# EAGLE design molex_breakout (EAGLE 7.7.0)
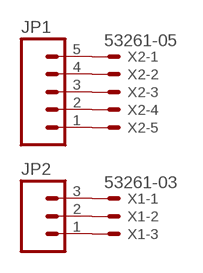
[diagram p0: schematic, sheet 1]

## Parts
JP1  M05PTH  [1X05]
JP2  M03PTH  [1X03]
X1  53261-03  [53261-03]
X2  53261-05  [53261-05]

## Nets
N$1: JP2.3 X1.1
N$2: JP2.2 X1.2
N$3: JP2.1 X1.3
N$4: JP1.5 X2.1
N$5: JP1.4 X2.2
N$6: JP1.3 X2.3
N$7: JP1.2 X2.4
N$8: JP1.1 X2.5

## Library data of the parts
JP1 = SparkFun-Connectors:M05: Header 5 Standard 5-pin 0.1" header. Use with straight break away headers (SKU : PRT-00116), right angle break away headers (PRT-00553), swiss pins (PRT-00743), machine pins (PRT-00117), and female headers (PRT-00115). Molex polarized connector foot print use with SKU : PRT-08230 with associated crimp pins and housings.
JP2 = SparkFun-Connectors:M03: Header 3 Standard 3-pin 0.1" header. Use with straight break away headers (SKU : PRT-00116), right angle break away headers (PRT-00553), swiss pins (PRT-00743), machine pins (PRT-00117), and female headers (PRT-00115). Molex polarized connector foot print use with SKU : PRT-08232 with associated crimp pins and housings.
X1 = con-molex:53?-03: CONNECTOR wire to board 1.25 mm (.049 inch) pitch header; MF: MOLEX; MPN: 53261-0390; OC_FARNELL: 1125359; OC_NEWARK: 57H5006
X2 = con-molex:53?-05: CONNECTOR wire to board 1.25 mm (.049 inch) pitch header; OC_FARNELL: 1433644; OC_NEWARK: unknown

## Board
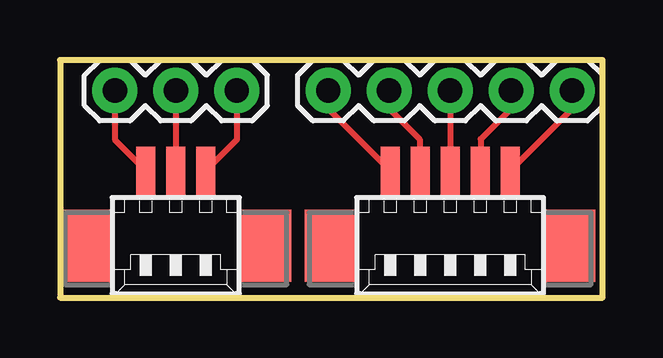
[diagram p1: board, top side]

Size 22.61 x 9.91 mm. Coordinates in mm from the lower left corner, seen from the top.
Outline: 0,0 22.61,0 22.61,9.91 0,9.91 0,0
Copper layers (1*16): Top 0.035mm / dielectric 1.5mm / Bottom 0.035mm
Design rules "default": minimum track width 10mil, minimum drill 24mil, track to track 8mil, track to pad 8mil, pad to pad 8mil, via to via 8mil, smd to smd 8mil, copper to edge 40mil, drill to drill 8mil, minimum pad ring 10mil, minimum via ring 8mil, stop-mask expansion 4mil, vias tented up to drill 0mil, thermal gap 10mil

### Footprints (pad centres in the part's own frame; a part is rotated, then mirrored left to right if it is on the bottom)
1X05 = drill 1.016 pad 1.88: 1 0,0; 2 2.54,0; 3 5.08,0; 4 7.62,0; 5 10.16,0
1X03 = drill 1.016 pad 1.88: 1 0,0; 2 2.54,0; 3 5.08,0
53261-03 = smd 0.8 x 2: 1 1.25,-2.5; 2 0,-2.5; 3 -1.25,-2.5 | smd 2.1 x 3: S1 3.75,0.625; S2 -3.75,0.625
53261-05 = smd 0.8 x 2: 1 2.5,-2.5; 2 1.25,-2.5; 3 0,-2.5; 4 -1.25,-2.5; 5 -2.5,-2.5 | smd 2.1 x 3: S1 5,0.625; S2 -5,0.625

### Placement (x,y rotation side)
JP1  21.34,8.64 180 top
JP2  7.37,8.64 180 top
X1  4.83,2.79 180 top
X2  16.26,2.79 180 top

### Tracks (layer width: path | path; a pad name or v marks a point on that pad's centre or on a via)
N$1
  Top 0.254: JP2.3 2.29,6.58 X1.1
N$2
  Top 0.254: JP2.2 X1.2
N$3
  Top 0.254: JP2.1 7.37,6.58 X1.3
N$4
  Top 0.254: JP1.5 11.18,7.87 X2.1
N$5
  Top 0.254: JP1.4 13.72,7.87 14.99,6.6 14.99,5.31 X2.2
N$6
  Top 0.254: JP1.3 X2.3
N$7
  Top 0.254: JP1.2 18.8,7.87 17.53,6.6 17.53,5.31 X2.4
N$8
  Top 0.254: JP1.1 21.34,7.87 X2.5